# EAGLE design USB&BT-Tastatursch_009 (EAGLE 6.3)
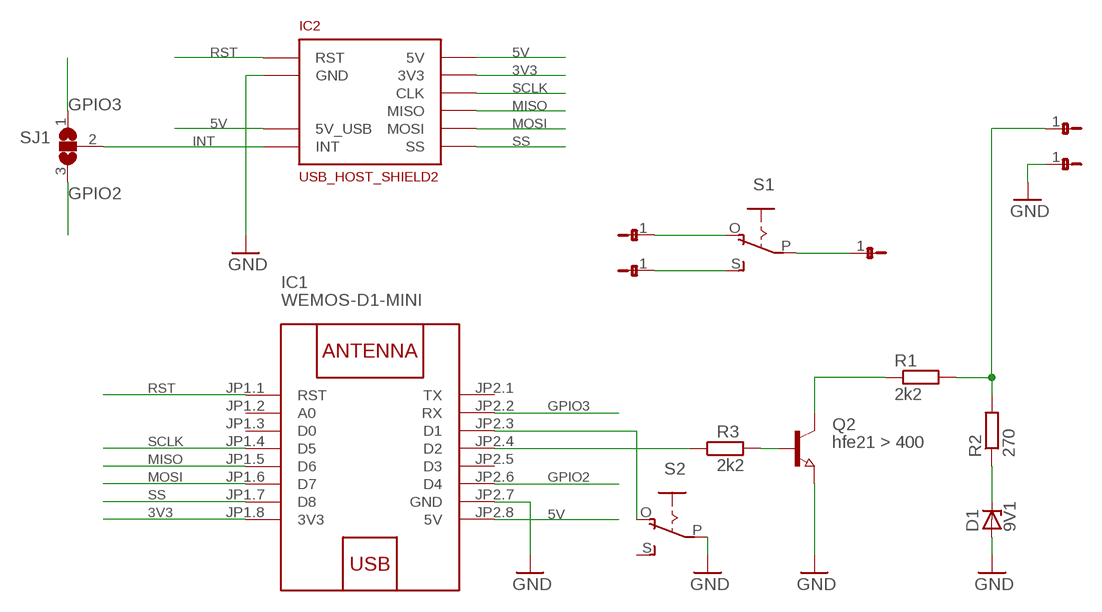
[diagram p0: schematic, sheet 1]

## Parts
D1  9V1  ZENER-DIODEDO34-7  [DO34Z7]
IC1  WEMOS-D1-MINI  WEMOS-D1-MINIWEMOS-D1-MINI-P  [WEMOS-D1-MINI_PUR]
IC2  USB_HOST_SHIELD2  [USB_HOST_SHIELD_2]
Q2  hfe21 > 400  NPN-TRANSISTOR_SOT23W  [SOT23W]
R1  2k2  R-EU_M0805  [M0805]
R2  270  R-EU_M0805  [M0805]
R3  2k2  R-EU_M0805  [M0805]
S1  EG1218S  [EG1218]
S2  EG1218S  [EG1218]
SJ1  SJ2WSJ_2B  [SJ_2B]
U$2  JP1-1JP1-1C  [JP1-1C]
U$3  JP1-1JP1-1C  [JP1-1C]
U$4  JP1-1JP1-1C  [JP1-1C]
U$5  JP1-1JP1-1C  [JP1-1C]
U$6  JP1-1JP1-1C  [JP1-1C]

## Nets
3V3: IC1.JP1.8(3V3) IC2.VCC(3V3)
5V: IC1.JP2.8(5V) IC2.5V IC2.5V_USB
GND: D1.A IC1.JP2.7(GND) IC2.GND IC2.GND@1(GND) Q2.3(E) S2.P U$3.1
GPIO2: IC1.JP2.6(D4) SJ1.3
GPIO3: IC1.JP2.2(RX) SJ1.1
INT: IC2.INT SJ1.2
MISO: IC1.JP1.5(D6) IC2.MISO
MOSI: IC1.JP1.6(D7) IC2.MOSI
N$1: IC1.JP2.3(D1) S2.O
N$2: IC1.JP2.4(D2) R3.1
N$3: R1.2 R2.2 U$2.1
N$4: D1.C R2.1
N$5: Q2.2(C) R1.1
N$6: S1.P U$4.1
N$7: S1.S U$6.1
N$8: Q2.1(B) R3.2
N$9: S1.O U$5.1
RST: IC1.JP1.1(RST) IC2.RST IC2.RST@1(RST)
SCLK: IC1.JP1.4(D5) IC2.CLK
SS: IC1.JP1.7(D8) IC2.SS
Unconnected: IC1.JP1.2(A0) IC1.JP1.3(D0) IC1.JP2.1(TX) IC1.JP2.5(D3) S2.S

## Library data of the parts
D1 = diode:ZENER-DIODE: Z-Diode
IC1 = diy-modules:WEMOS-D1-MINI: WEMOS D1 mini: Mini Wi-Fi Board based on ESP-8266 device More details can be found here: https://www.wemos.cc/product/d1-mini.html Click here to find device on ebay.com <http://www.ebay.com/sch/wemos+d1+mini+nodemcu>
IC2 = NRF24L01_Radio:USB_HOST_SHIELD
Q2 = semicon-smd-ipc:NPN-TRANSISTOR_: NPN TRANSISTOR
R1-R3 = rcl:R-EU_: RESISTOR, European symbol
S1 S2 = adafruit:EG1218: SLIDING SWITCH 0.1" spacing through hole, vertical SPDT slide switch http://www.ladyada.net/library/pcb/eaglelibrary.html
SJ1 = jumper:SJ2W: SMD solder JUMPER
U$2-U$6 = NRF24L01_Radio:JP1-1

## Board
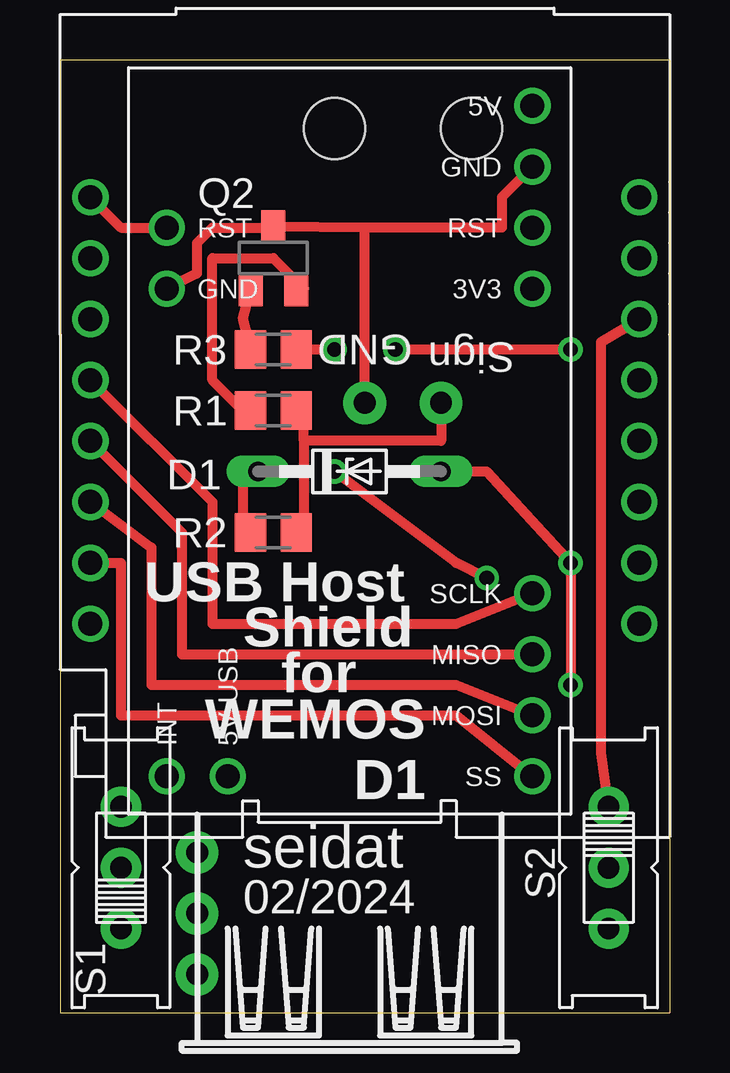
[diagram p1: board, top side]
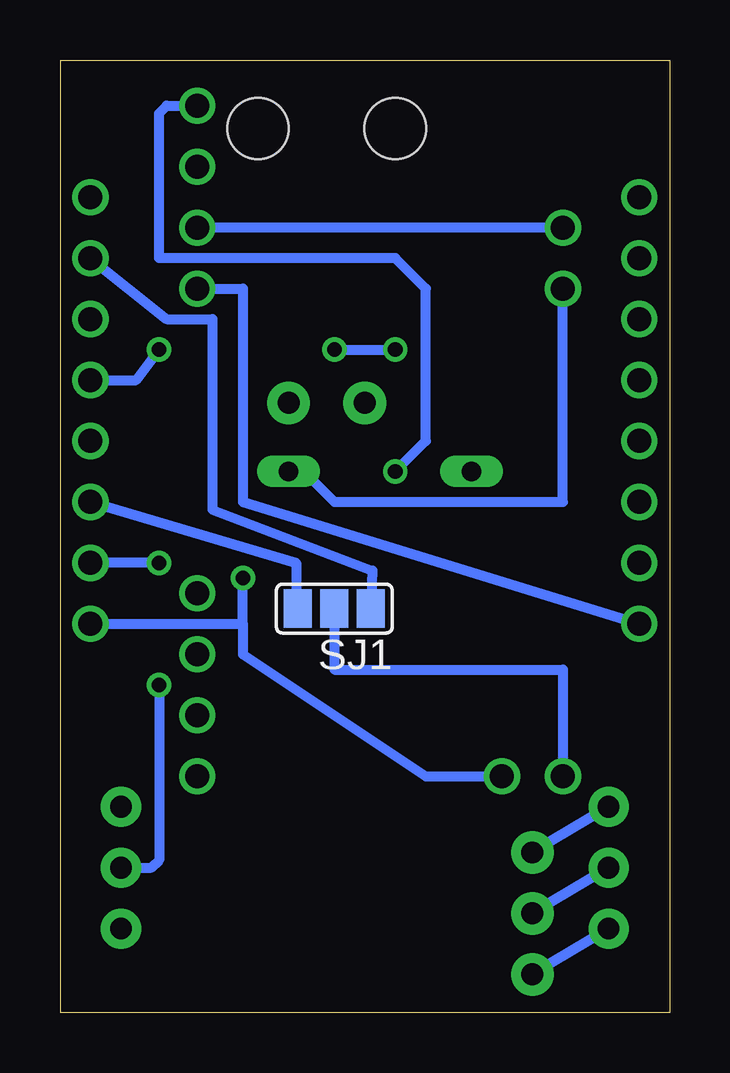
[diagram p2: board, bottom side, seen from below]

Size 25.4 x 39.69 mm. Coordinates in mm from the lower left corner, seen from the top.
Outline: 0,0 25.4,0 25.4,39.69 0,39.69 0,0
Copper layers (1*16): Top 0.035mm / dielectric 1.5mm / Bottom 0.035mm
Design rules "default *": minimum track width 16mil, minimum drill 24mil, track to track 8mil, track to pad 8mil, pad to pad 8mil, via to via 8mil, smd to smd 8mil, copper to edge 10mil, drill to drill 8mil, minimum pad ring 10mil, minimum via ring 8mil, stop-mask expansion 4mil, vias tented up to drill 0mil, thermal gap 10mil
Holes 2.55 mm at 11.43,36.83 17.14,36.83

### Footprints (pad centres in the part's own frame; a part is rotated, then mirrored left to right if it is on the bottom)
DO34Z7 = drill 0.813 long: A 3.81,0; C -3.81,0
WEMOS-D1-MINI_PUR = drill 1: JP1.1 -11.43,7.62; JP1.2 -11.43,5.08; JP1.3 -11.43,2.54; JP1.4 -11.43,0; JP1.5 -11.43,-2.54; JP1.6 -11.43,-5.08; JP1.7 -11.43,-7.62; JP1.8 -11.43,-10.16; JP2.1 11.43,7.62; JP2.2 11.43,5.08; JP2.3 11.43,2.54; JP2.4 11.43,0; JP2.5 11.43,-2.54; JP2.6 11.43,-5.08; JP2.7 11.43,-7.62; JP2.8 11.43,-10.16
USB_HOST_SHIELD_2 = drill 1: 5V 7.62,13.97; 5V_USB -5.08,-13.97; CLK 7.62,-6.35; GND -7.62,6.35; GND@1 7.62,11.43; INT -7.62,-13.97; MISO 7.62,-8.89; MOSI 7.62,-11.43; RST 7.62,8.89; RST@1 -7.62,8.89; SS 7.62,-13.97; VCC 7.62,6.35
SOT23W = smd 1 x 1.4: 1 -0.95,-1.303; 2 0.95,-1.303; 3 0,1.303
M0805 = smd 1.3 x 1.6: 1 -0.95,0; 2 0.95,0
EG1218 = drill 0.9 pad 1.676: O -2.54,0; P 0,0; S 2.54,0
SJ_2B = smd 1.168 x 1.6: 1 -1.524,0; 2 0,0; 3 1.524,0
JP1-1C = drill 0.914 pad 1.778: 1 0,0

### Placement (x,y rotation side)
D1  12.07,22.54 0 top
IC1  12.7,26.35 0 top
IC2  12.07,23.81 0 top
Q2  8.89,31.43 0 top
R1  8.89,25.08 0 top
R2  8.89,20 0 top
R3  8.89,27.62 180 top
S1  2.54,6.03 90 top
S2  22.86,6.03 270 top
SJ1  13.97,16.83 180 bottom
U$2  15.88,25.4 0 top
U$3  12.7,25.4 0 top
U$4  5.71,4.13 0 top
U$5  5.71,1.59 0 top
U$6  5.71,6.67 0 top

### Tracks (layer width: path | path; a pad name or v marks a point on that pad's centre or on a via)
3V3
  Bottom 0.406: IC2.VCC 17.78,30.16 17.78,21.27 IC1.JP1.8
5V  (via drill 0.61)
  Top 0.406: v11.43,22.54 16.51,18.73 v17.78,18.1
  Bottom 0.406: IC2.5V_USB 10.16,9.84 17.78,14.92 17.78,16.19 | 17.78,16.19 v17.78,18.1 | v11.43,22.54 10.16,23.81 10.16,30.16 11.43,31.43 21.27,31.43 21.27,37.47 20.96,37.78 IC2.5V | IC1.JP2.8 17.78,16.19
GND  (via drill 0.61)
  Top 0.406: D1.A 17.78,22.54 v21.27,18.73 v21.27,13.65 | IC2.GND 5.71,30.8 5.71,32.07 6.35,32.7 8.89,32.7 Q2.3 12.7,32.7 | U$3.1 12.7,32.7 | IC2.GND@1 18.41,33.97 18.41,32.7 12.7,32.7
  Bottom 0.406: IC2.GND 4.45,21.27 13.97,21.27 15.24,22.54 D1.A | v21.27,18.73 IC1.JP2.7 | S2.P 21.59,6.03 21.27,6.35 v21.27,13.65
GPIO2
  Bottom 0.406: IC1.JP2.6 15.56,18.73 15.56,17.46 SJ1.3
GPIO3
  Bottom 0.406: IC1.JP2.2 20.96,28.89 19.05,28.89 19.05,20.95 12.38,18.42 SJ1.1
INT
  Bottom 0.406: SJ1.2 13.97,14.29 4.45,14.29 IC2.INT
MISO
  Top 0.406: IC1.JP1.5 5.08,20 5.08,14.92 IC2.MISO
MOSI
  Top 0.406: IC1.JP1.6 3.81,19.37 3.81,13.65 16.51,13.65 IC2.MOSI
N$1
  Top 0.406: IC1.JP2.3 22.54,27.94 22.54,10.8 S2.O
N$2  (via drill 0.61)
  Top 0.406: v11.43,27.62 R3.1 | v21.27,27.62 v13.97,27.62
  Bottom 0.406: v13.97,27.62 v11.43,27.62 | v21.27,27.62 22.23,26.35 IC1.JP2.4
N$3
  Top 0.406: 10.16,23.81 10.16,20 R2.2 | 10.16,23.81 15.88,23.81 U$2.1 | 10.16,23.81 10.16,25.08 R1.2
N$4
  Top 0.406: R2.1 7.62,20 7.62,22.54 D1.C
N$5
  Top 0.406: Q2.2 10.16,30.16 8.89,31.43 6.35,31.43 6.35,26.35 7.62,25.08 R1.1
N$6
  Bottom 0.406: S1.P U$4.1
N$7
  Bottom 0.406: S1.S U$6.1
N$8
  Top 0.406: Q2.1 7.62,28.89 R3.2
N$9
  Bottom 0.406: S1.O U$5.1
RST
  Top 0.406: IC1.JP1.1 2.54,32.7 IC2.RST@1
  Bottom 0.406: IC2.RST@1 IC2.RST
SCLK
  Top 0.406: IC1.JP1.4 6.35,21.27 6.35,16.19 16.51,16.19 IC2.CLK
SS
  Top 0.406: IC1.JP1.7 2.54,18.73 2.54,12.38 16.51,12.38 IC2.SS

### Text on the board
tPlace: seidat | 02/2024
tNames: GND | Sign | Shield | USB Host | for | WEMOS / D1